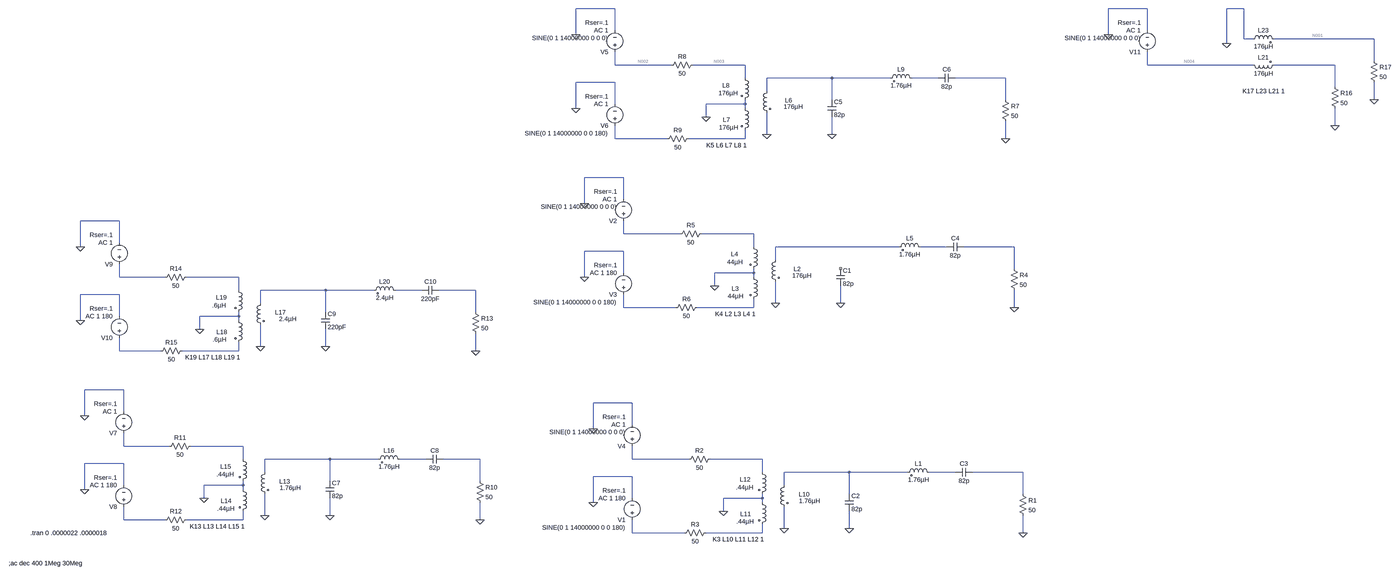
[diagram p0: schematic Combiner.asc, whole sheet]
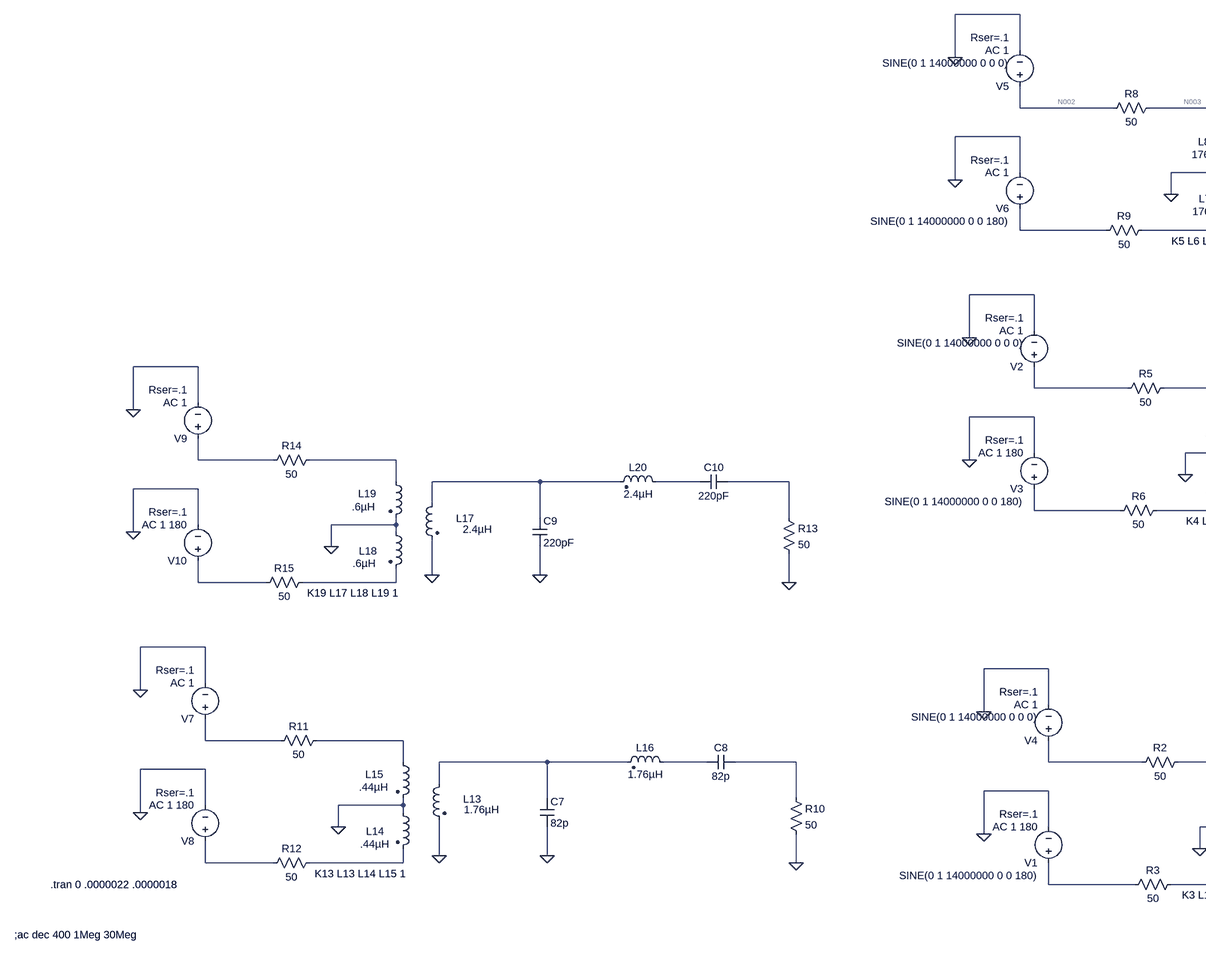
[diagram p1: schematic Combiner.asc, part, row 1 of 1, column 1 of 2]
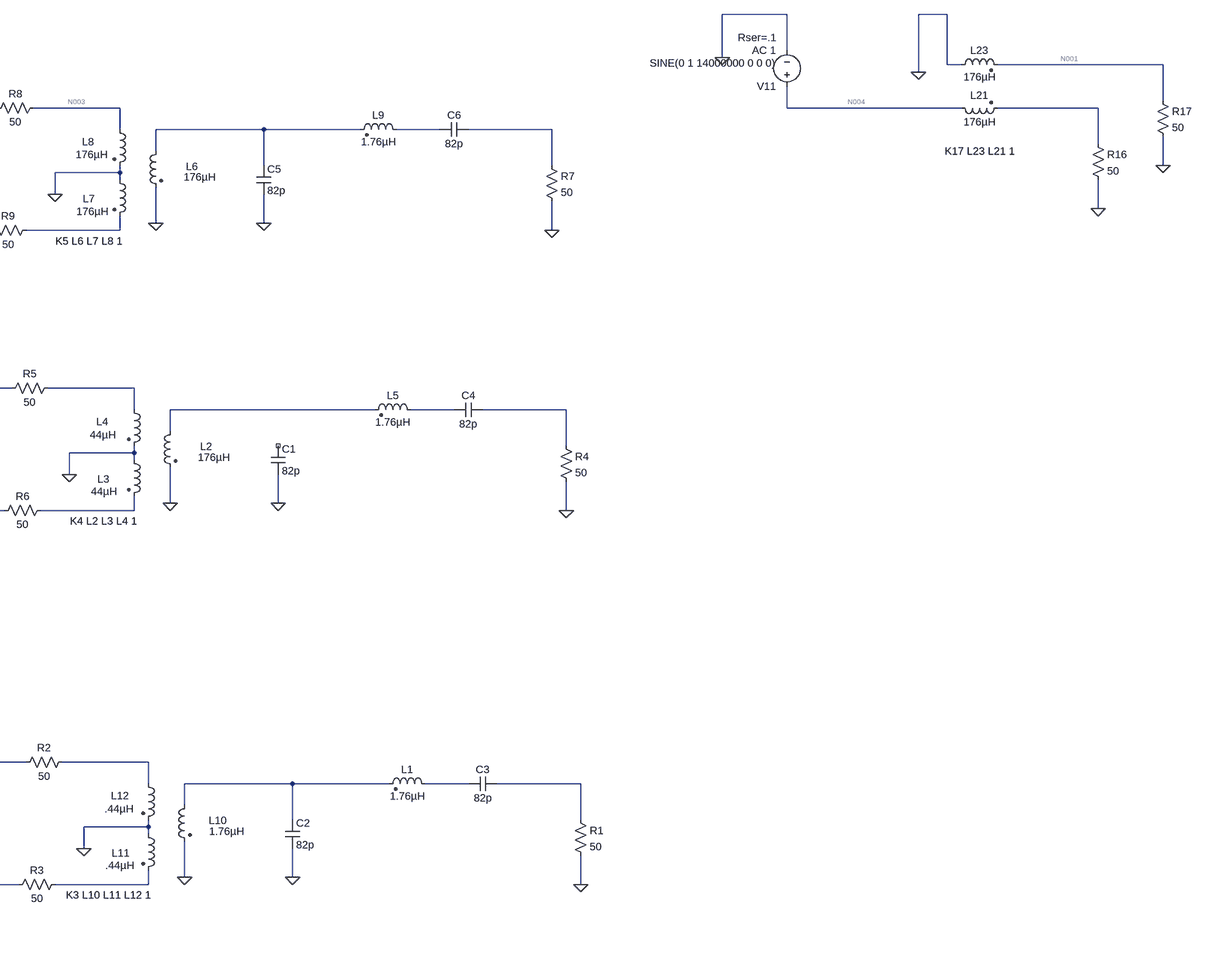
[diagram p2: schematic Combiner.asc, part, row 1 of 1, column 2 of 2]
Combiner.asc, the LTspice schematic file:
Version 4
SHEET 1 4500 776
WIRE 672 -1744 528 -1744
WIRE 2960 -1744 2816 -1744
WIRE 3456 -1744 3392 -1744
WIRE 672 -1664 672 -1744
WIRE 2960 -1664 2960 -1744
WIRE 528 -1648 528 -1744
WIRE 2816 -1648 2816 -1744
WIRE 3456 -1632 3456 -1744
WIRE 3488 -1632 3456 -1632
WIRE 3984 -1632 3568 -1632
WIRE 3392 -1616 3392 -1744
WIRE 3984 -1552 3984 -1632
WIRE 672 -1536 672 -1584
WIRE 880 -1536 672 -1536
WIRE 1152 -1536 960 -1536
WIRE 2960 -1536 2960 -1584
WIRE 3488 -1536 2960 -1536
WIRE 3840 -1536 3568 -1536
WIRE 1152 -1488 1152 -1536
WIRE 1472 -1488 1232 -1488
WIRE 1712 -1488 1472 -1488
WIRE 1888 -1488 1792 -1488
WIRE 2224 -1488 1952 -1488
WIRE 672 -1472 528 -1472
WIRE 3840 -1456 3840 -1536
WIRE 1232 -1440 1232 -1488
WIRE 1472 -1408 1472 -1488
WIRE 2224 -1408 2224 -1488
WIRE 3984 -1408 3984 -1472
WIRE 672 -1392 672 -1472
WIRE 1152 -1392 1152 -1408
WIRE 1152 -1392 1008 -1392
WIRE 528 -1376 528 -1472
WIRE 1152 -1376 1152 -1392
WIRE 1008 -1344 1008 -1392
WIRE 3840 -1312 3840 -1376
WIRE 1232 -1280 1232 -1360
WIRE 1472 -1280 1472 -1344
WIRE 672 -1264 672 -1312
WIRE 864 -1264 672 -1264
WIRE 1152 -1264 1152 -1296
WIRE 1152 -1264 944 -1264
WIRE 2224 -1264 2224 -1328
WIRE 704 -1056 560 -1056
WIRE 704 -976 704 -1056
WIRE 560 -960 560 -1056
WIRE -1488 -896 -1632 -896
WIRE 704 -848 704 -896
WIRE 912 -848 704 -848
WIRE 1184 -848 992 -848
WIRE -1488 -816 -1488 -896
WIRE -1632 -800 -1632 -896
WIRE 1184 -800 1184 -848
WIRE 1744 -800 1264 -800
WIRE 1920 -800 1824 -800
WIRE 2256 -800 1984 -800
WIRE 704 -784 560 -784
WIRE 1264 -752 1264 -800
WIRE 2256 -720 2256 -800
WIRE 704 -704 704 -784
WIRE 1184 -704 1184 -720
WIRE 1184 -704 1040 -704
WIRE -1488 -688 -1488 -736
WIRE -1280 -688 -1488 -688
WIRE -1008 -688 -1200 -688
WIRE 560 -688 560 -784
WIRE 1184 -688 1184 -704
WIRE 1040 -656 1040 -704
WIRE -1008 -640 -1008 -688
WIRE -688 -640 -928 -640
WIRE -448 -640 -688 -640
WIRE -272 -640 -368 -640
WIRE 64 -640 -208 -640
WIRE -1488 -624 -1632 -624
WIRE -928 -592 -928 -640
WIRE 1264 -592 1264 -672
WIRE 1504 -592 1504 -656
WIRE 704 -576 704 -624
WIRE 896 -576 704 -576
WIRE 1184 -576 1184 -608
WIRE 1184 -576 976 -576
WIRE 2256 -576 2256 -640
WIRE -688 -560 -688 -640
WIRE 64 -560 64 -640
WIRE -1488 -544 -1488 -624
WIRE -1008 -544 -1008 -560
WIRE -1008 -544 -1152 -544
WIRE -1632 -528 -1632 -624
WIRE -1008 -528 -1008 -544
WIRE -1152 -496 -1152 -544
WIRE -928 -432 -928 -512
WIRE -688 -432 -688 -496
WIRE -1488 -416 -1488 -464
WIRE -1296 -416 -1488 -416
WIRE -1008 -416 -1008 -448
WIRE -1008 -416 -1216 -416
WIRE 64 -416 64 -480
WIRE -1472 -224 -1616 -224
WIRE 736 -176 592 -176
WIRE -1472 -144 -1472 -224
WIRE -1616 -128 -1616 -224
WIRE 736 -96 736 -176
WIRE 592 -80 592 -176
WIRE -1472 -16 -1472 -64
WIRE -1264 -16 -1472 -16
WIRE -992 -16 -1184 -16
WIRE -992 32 -992 -16
WIRE -672 32 -912 32
WIRE -432 32 -672 32
WIRE -256 32 -352 32
WIRE 80 32 -192 32
WIRE 736 32 736 -16
WIRE 944 32 736 32
WIRE 1216 32 1024 32
WIRE -1472 48 -1616 48
WIRE -912 80 -912 32
WIRE 1216 80 1216 32
WIRE 1536 80 1296 80
WIRE 1776 80 1536 80
WIRE 1952 80 1856 80
WIRE 2288 80 2016 80
WIRE 736 96 592 96
WIRE -672 112 -672 32
WIRE 80 112 80 32
WIRE -1472 128 -1472 48
WIRE -992 128 -992 112
WIRE -992 128 -1136 128
WIRE 1296 128 1296 80
WIRE -1616 144 -1616 48
WIRE -992 144 -992 128
WIRE 1536 160 1536 80
WIRE 2288 160 2288 80
WIRE -1136 176 -1136 128
WIRE 736 176 736 96
WIRE 1216 176 1216 160
WIRE 1216 176 1072 176
WIRE 592 192 592 96
WIRE 1216 192 1216 176
WIRE 1072 224 1072 176
WIRE -912 240 -912 160
WIRE -672 240 -672 176
WIRE -1472 256 -1472 208
WIRE -1280 256 -1472 256
WIRE -992 256 -992 224
WIRE -992 256 -1200 256
WIRE 80 256 80 192
WIRE 1296 288 1296 208
WIRE 1536 288 1536 224
WIRE 736 304 736 256
WIRE 928 304 736 304
WIRE 1216 304 1216 272
WIRE 1216 304 1008 304
WIRE 2288 304 2288 240
FLAG 592 -80 0
FLAG 1072 224 0
FLAG 592 192 0
FLAG 1296 288 0
FLAG 1536 288 0
FLAG 2288 304 0
FLAG 560 -960 0
FLAG 1040 -656 0
FLAG 560 -688 0
FLAG 1264 -592 0
FLAG 1504 -592 0
FLAG 2256 -576 0
FLAG 528 -1648 0
FLAG 1008 -1344 0
FLAG 528 -1376 0
FLAG 1232 -1280 0
FLAG 1472 -1280 0
FLAG 2224 -1264 0
FLAG -1616 -128 0
FLAG -1136 176 0
FLAG -1616 144 0
FLAG -912 240 0
FLAG -672 240 0
FLAG 80 256 0
FLAG -1632 -800 0
FLAG -1152 -496 0
FLAG -1632 -528 0
FLAG -928 -432 0
FLAG -688 -432 0
FLAG 64 -416 0
FLAG 2816 -1648 0
FLAG 3392 -1616 0
FLAG 3840 -1312 0
FLAG 3984 -1408 0
SYMBOL ind2 1312 112 M0
WINDOW 0 -78 50 Left 2
WINDOW 3 -117 74 Left 2
SYMATTR InstName L10
SYMATTR Value 1.76µH
SYMATTR Type ind
SYMBOL ind2 1200 176 R0
WINDOW 0 -66 58 Left 2
WINDOW 3 -80 86 Left 2
SYMATTR InstName L11
SYMATTR Value .44µH
SYMATTR Type ind
SYMBOL ind2 1200 64 R0
WINDOW 0 -68 43 Left 2
WINDOW 3 -82 72 Left 2
SYMATTR InstName L12
SYMATTR Value .44µH
SYMATTR Type ind
SYMBOL voltage 736 0 R180
WINDOW 123 24 96 Left 2
WINDOW 39 24 124 Left 2
WINDOW 3 24 68 Left 2
SYMATTR Value2 AC 1
SYMATTR SpiceLine Rser=.1
SYMATTR Value SINE(0 1 14000000 0 0 0)
SYMATTR InstName V4
SYMBOL voltage 736 272 R180
WINDOW 123 24 96 Left 2
WINDOW 39 24 124 Left 2
WINDOW 3 24 -12 Left 2
SYMATTR Value2 AC 1 180
SYMATTR SpiceLine Rser=.1
SYMATTR Value SINE(0 1 14000000 0 0 180)
SYMATTR InstName V1
SYMBOL cap 1520 160 R0
SYMATTR InstName C2
SYMATTR Value 82p
SYMBOL res 2272 144 R0
SYMATTR InstName R1
SYMATTR Value 50
SYMBOL ind2 1872 96 M270
WINDOW 0 32 56 VTop 2
WINDOW 3 4 56 VBottom 2
SYMATTR InstName L1
SYMATTR Value 1.76µH
SYMATTR Type ind
SYMBOL cap 2016 64 R90
WINDOW 0 0 32 VBottom 2
WINDOW 3 32 32 VTop 2
SYMATTR InstName C3
SYMATTR Value 82p
SYMBOL res 1040 16 R90
WINDOW 0 0 56 VBottom 2
WINDOW 3 32 56 VTop 2
SYMATTR InstName R2
SYMATTR Value 50
SYMBOL res 1024 288 R90
WINDOW 0 0 56 VBottom 2
WINDOW 3 32 56 VTop 2
SYMATTR InstName R3
SYMATTR Value 50
SYMBOL ind2 1280 -768 M0
WINDOW 0 -78 50 Left 2
WINDOW 3 -117 74 Left 2
SYMATTR InstName L2
SYMATTR Value 176µH
SYMATTR Type ind
SYMBOL ind2 1168 -704 R0
WINDOW 0 -66 58 Left 2
WINDOW 3 -80 86 Left 2
SYMATTR InstName L3
SYMATTR Value 44µH
SYMATTR Type ind
SYMBOL ind2 1168 -816 R0
WINDOW 0 -68 43 Left 2
WINDOW 3 -82 72 Left 2
SYMATTR InstName L4
SYMATTR Value 44µH
SYMATTR Type ind
SYMBOL voltage 704 -880 R180
WINDOW 123 24 96 Left 2
WINDOW 39 24 124 Left 2
WINDOW 3 24 68 Left 2
SYMATTR Value2 AC 1
SYMATTR SpiceLine Rser=.1
SYMATTR Value SINE(0 1 14000000 0 0 0)
SYMATTR InstName V2
SYMBOL voltage 704 -608 R180
WINDOW 123 24 96 Left 2
WINDOW 39 24 124 Left 2
WINDOW 3 24 -12 Left 2
SYMATTR Value2 AC 1 180
SYMATTR SpiceLine Rser=.1
SYMATTR Value SINE(0 1 14000000 0 0 180)
SYMATTR InstName V3
SYMBOL cap 1488 -720 R0
SYMATTR InstName C1
SYMATTR Value 82p
SYMBOL res 2240 -736 R0
SYMATTR InstName R4
SYMATTR Value 50
SYMBOL ind2 1840 -784 M270
WINDOW 0 32 56 VTop 2
WINDOW 3 4 56 VBottom 2
SYMATTR InstName L5
SYMATTR Value 1.76µH
SYMATTR Type ind
SYMBOL cap 1984 -816 R90
WINDOW 0 0 32 VBottom 2
WINDOW 3 32 32 VTop 2
SYMATTR InstName C4
SYMATTR Value 82p
SYMBOL res 1008 -864 R90
WINDOW 0 0 56 VBottom 2
WINDOW 3 32 56 VTop 2
SYMATTR InstName R5
SYMATTR Value 50
SYMBOL res 992 -592 R90
WINDOW 0 0 56 VBottom 2
WINDOW 3 32 56 VTop 2
SYMATTR InstName R6
SYMATTR Value 50
SYMBOL ind2 1248 -1456 M0
WINDOW 0 -78 50 Left 2
WINDOW 3 -117 74 Left 2
SYMATTR InstName L6
SYMATTR Value 176µH
SYMATTR Type ind
SYMBOL ind2 1136 -1392 R0
WINDOW 0 -66 58 Left 2
WINDOW 3 -80 86 Left 2
SYMATTR InstName L7
SYMATTR Value 176µH
SYMATTR Type ind
SYMBOL ind2 1136 -1504 R0
WINDOW 0 -68 43 Left 2
WINDOW 3 -82 72 Left 2
SYMATTR InstName L8
SYMATTR Value 176µH
SYMATTR Type ind
SYMBOL voltage 672 -1568 R180
WINDOW 123 24 96 Left 2
WINDOW 39 24 124 Left 2
WINDOW 3 24 68 Left 2
SYMATTR Value2 AC 1
SYMATTR SpiceLine Rser=.1
SYMATTR Value SINE(0 1 14000000 0 0 0)
SYMATTR InstName V5
SYMBOL voltage 672 -1296 R180
WINDOW 123 24 96 Left 2
WINDOW 39 24 124 Left 2
WINDOW 3 24 -12 Left 2
SYMATTR Value2 AC 1
SYMATTR SpiceLine Rser=.1
SYMATTR Value SINE(0 1 14000000 0 0 180)
SYMATTR InstName V6
SYMBOL cap 1456 -1408 R0
SYMATTR InstName C5
SYMATTR Value 82p
SYMBOL res 2208 -1424 R0
SYMATTR InstName R7
SYMATTR Value 50
SYMBOL ind2 1808 -1472 M270
WINDOW 0 32 56 VTop 2
WINDOW 3 4 56 VBottom 2
SYMATTR InstName L9
SYMATTR Value 1.76µH
SYMATTR Type ind
SYMBOL cap 1952 -1504 R90
WINDOW 0 0 32 VBottom 2
WINDOW 3 32 32 VTop 2
SYMATTR InstName C6
SYMATTR Value 82p
SYMBOL res 976 -1552 R90
WINDOW 0 0 56 VBottom 2
WINDOW 3 32 56 VTop 2
SYMATTR InstName R8
SYMATTR Value 50
SYMBOL res 960 -1280 R90
WINDOW 0 0 56 VBottom 2
WINDOW 3 32 56 VTop 2
SYMATTR InstName R9
SYMATTR Value 50
SYMBOL ind2 -896 64 M0
WINDOW 0 -78 50 Left 2
WINDOW 3 -117 74 Left 2
SYMATTR InstName L13
SYMATTR Value 1.76µH
SYMATTR Type ind
SYMBOL ind2 -1008 128 R0
WINDOW 0 -66 58 Left 2
WINDOW 3 -80 86 Left 2
SYMATTR InstName L14
SYMATTR Value .44µH
SYMATTR Type ind
SYMBOL ind2 -1008 16 R0
WINDOW 0 -68 43 Left 2
WINDOW 3 -82 72 Left 2
SYMATTR InstName L15
SYMATTR Value .44µH
SYMATTR Type ind
SYMBOL voltage -1472 -48 R180
WINDOW 123 24 96 Left 2
WINDOW 39 24 124 Left 2
WINDOW 3 24 68 Left 2
SYMATTR Value2 AC 1
SYMATTR SpiceLine Rser=.1
SYMATTR Value ""
SYMATTR InstName V7
SYMBOL voltage -1472 224 R180
WINDOW 123 24 96 Left 2
WINDOW 39 24 124 Left 2
WINDOW 3 24 -12 Left 2
SYMATTR Value2 AC 1 180
SYMATTR SpiceLine Rser=.1
SYMATTR Value ""
SYMATTR InstName V8
SYMBOL cap -688 112 R0
SYMATTR InstName C7
SYMATTR Value 82p
SYMBOL res 64 96 R0
SYMATTR InstName R10
SYMATTR Value 50
SYMBOL ind2 -336 48 M270
WINDOW 0 32 56 VTop 2
WINDOW 3 4 56 VBottom 2
SYMATTR InstName L16
SYMATTR Value 1.76µH
SYMATTR Type ind
SYMBOL cap -192 16 R90
WINDOW 0 0 32 VBottom 2
WINDOW 3 32 32 VTop 2
SYMATTR InstName C8
SYMATTR Value 82p
SYMBOL res -1168 -32 R90
WINDOW 0 0 56 VBottom 2
WINDOW 3 32 56 VTop 2
SYMATTR InstName R11
SYMATTR Value 50
SYMBOL res -1184 240 R90
WINDOW 0 0 56 VBottom 2
WINDOW 3 32 56 VTop 2
SYMATTR InstName R12
SYMATTR Value 50
SYMBOL ind2 -912 -608 M0
WINDOW 0 -78 50 Left 2
WINDOW 3 -117 74 Left 2
SYMATTR InstName L17
SYMATTR Value 2.4µH
SYMATTR Type ind
SYMBOL ind2 -1024 -544 R0
WINDOW 0 -66 58 Left 2
WINDOW 3 -80 86 Left 2
SYMATTR InstName L18
SYMATTR Value .6µH
SYMATTR Type ind
SYMBOL ind2 -1024 -656 R0
WINDOW 0 -68 43 Left 2
WINDOW 3 -82 72 Left 2
SYMATTR InstName L19
SYMATTR Value .6µH
SYMATTR Type ind
SYMBOL voltage -1488 -720 R180
WINDOW 123 24 96 Left 2
WINDOW 39 24 124 Left 2
WINDOW 3 24 68 Left 2
SYMATTR Value2 AC 1
SYMATTR SpiceLine Rser=.1
SYMATTR Value ""
SYMATTR InstName V9
SYMBOL voltage -1488 -448 R180
WINDOW 123 24 96 Left 2
WINDOW 39 24 124 Left 2
WINDOW 3 24 -12 Left 2
SYMATTR Value2 AC 1 180
SYMATTR SpiceLine Rser=.1
SYMATTR Value ""
SYMATTR InstName V10
SYMBOL cap -704 -560 R0
SYMATTR InstName C9
SYMATTR Value 220pF
SYMBOL res 48 -576 R0
SYMATTR InstName R13
SYMATTR Value 50
SYMBOL ind2 -352 -624 M270
WINDOW 0 32 56 VTop 2
WINDOW 3 4 56 VBottom 2
SYMATTR InstName L20
SYMATTR Value 2.4µH
SYMATTR Type ind
SYMBOL cap -208 -656 R90
WINDOW 0 0 32 VBottom 2
WINDOW 3 32 32 VTop 2
SYMATTR InstName C10
SYMATTR Value 220pF
SYMBOL res -1184 -704 R90
WINDOW 0 0 56 VBottom 2
WINDOW 3 32 56 VTop 2
SYMATTR InstName R14
SYMATTR Value 50
SYMBOL res -1200 -432 R90
WINDOW 0 0 56 VBottom 2
WINDOW 3 32 56 VTop 2
SYMATTR InstName R15
SYMATTR Value 50
SYMBOL ind2 3472 -1552 M90
WINDOW 0 4 56 VBottom 2
WINDOW 3 32 56 VTop 2
SYMATTR InstName L21
SYMATTR Value 176µH
SYMATTR Type ind
SYMBOL ind2 3472 -1616 R270
WINDOW 0 32 56 VTop 2
WINDOW 3 4 56 VBottom 2
SYMATTR InstName L23
SYMATTR Value 176µH
SYMATTR Type ind
SYMBOL voltage 2960 -1568 R180
WINDOW 123 24 96 Left 2
WINDOW 39 24 124 Left 2
WINDOW 3 24 68 Left 2
SYMATTR Value2 AC 1
SYMATTR SpiceLine Rser=.1
SYMATTR Value SINE(0 1 14000000 0 0 0)
SYMATTR InstName V11
SYMBOL res 3824 -1472 R0
SYMATTR InstName R16
SYMATTR Value 50
SYMBOL res 3968 -1568 R0
SYMATTR InstName R17
SYMATTR Value 50
TEXT 1224 328 Right 2 !K3 L10 L11 L12 1
TEXT 1192 -552 Right 2 !K4 L2 L3 L4 1
TEXT 1160 -1240 Right 2 !K5 L6 L7 L8 1
TEXT -984 280 Right 2 !K13 L13 L14 L15 1
TEXT -1816 304 Left 2 !.tran 0 .0000022 .0000018
TEXT -1896 416 Left 2 !;ac dec 400 1Meg 30Meg
TEXT -1000 -392 Right 2 !K19 L17 L18 L19 1
TEXT 3608 -1440 Right 2 !K17 L23 L21 1

The netlist it stands for:
* Combiner.asc
L10 N032 0 1.76µH
L11 0 N038 .44µH
L12 N031 0 .44µH
V4 N030 0 SINE(0 1 14000000 0 0 0) AC 1 Rser=.1
V1 N037 0 SINE(0 1 14000000 0 0 180) AC 1 180 Rser=.1
C2 N032 0 82p
R1 N034 0 50
L1 N033 N032 1.76µH
C3 N034 N033 82p
R2 N031 N030 50
R3 N038 N037 50
L2 N013 0 176µH
L3 0 N022 44µH
L4 N012 0 44µH
V2 N011 0 SINE(0 1 14000000 0 0 0) AC 1 Rser=.1
V3 N021 0 SINE(0 1 14000000 0 0 180) AC 1 180 Rser=.1
C1 NC_01 0 82p
R4 N015 0 50
L5 N014 N013 1.76µH
C4 N015 N014 82p
R5 N012 N011 50
R6 N022 N021 50
L6 N006 0 176µH
L7 0 N010 176µH
L8 N003 0 176µH
V5 N002 0 SINE(0 1 14000000 0 0 0) AC 1 Rser=.1
V6 N009 0 SINE(0 1 14000000 0 0 180) AC 1 Rser=.1
C5 N006 0 82p
R7 N008 0 50
L9 N007 N006 1.76µH
C6 N008 N007 82p
R8 N003 N002 50
R9 N010 N009 50
L13 N027 0 1.76µH
L14 0 N036 .44µH
L15 N026 0 .44µH
V7 N025 0 AC 1 Rser=.1
V8 N035 0 AC 1 180 Rser=.1
C7 N027 0 82p
R10 N029 0 50
L16 N028 N027 1.76µH
C8 N029 N028 82p
R11 N026 N025 50
R12 N036 N035 50
L17 N018 0 2.4µH
L18 0 N024 .6µH
L19 N017 0 .6µH
V9 N016 0 AC 1 Rser=.1
V10 N023 0 AC 1 180 Rser=.1
C9 N018 0 220pF
R13 N020 0 50
L20 N019 N018 2.4µH
C10 N020 N019 220pF
R14 N017 N016 50
R15 N024 N023 50
L21 N004 N005 176µH
L23 0 N001 176µH
V11 N004 0 SINE(0 1 14000000 0 0 0) AC 1 Rser=.1
R16 N005 0 50
R17 N001 0 50
K3 L10 L11 L12 1
K4 L2 L3 L4 1
K5 L6 L7 L8 1
K13 L13 L14 L15 1
.tran 0 .0000022 .0000018
;ac dec 400 1Meg 30Meg
K19 L17 L18 L19 1
K17 L23 L21 1
.backanno
.end

* Results of the author's LTspice run, read from the files saved beside the schematic
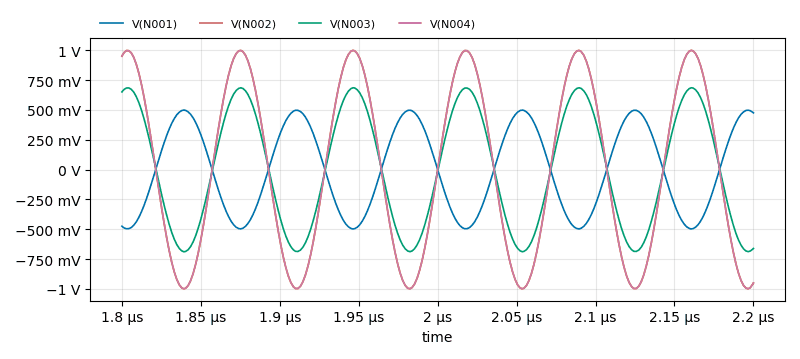
[diagram p3: Transient Analysis of Combiner.asc, plotted from the saved traces]
* Transient Analysis, 1 run:
*   V(N001): min -497.5 mV, max 498.8 mV, average 645.8 µV, rms 354.5 mV, last 475.4 mV
*   V(N002): min -999.4 mV, max 999.3 mV, average 2.345 µV, rms 712.6 mV, last -950.5 mV
*   V(N003): min -688.8 mV, max 685.8 mV, average -481.5 µV, rms 489.2 mV, last -660.7 mV
*   V(N004): min -999 mV, max 999 mV, average 2.011 µV, rms 712.3 mV, last -950.1 mV